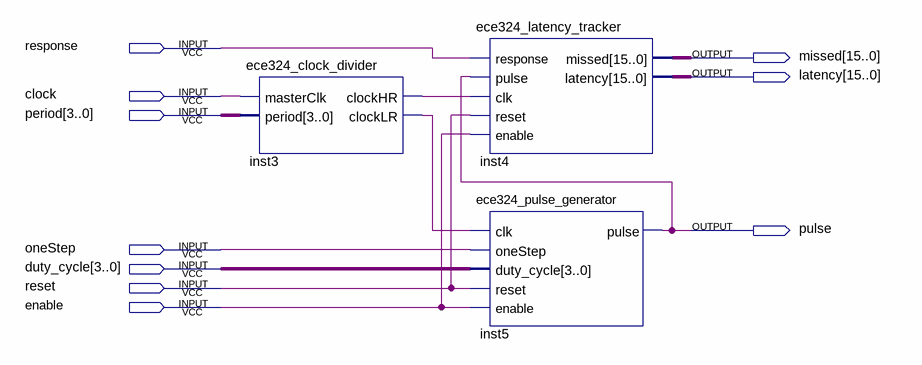
[diagram p0: schematic sheet]
// Quartus schematic ece324_egm.bdf as structural Verilog: 3 symbols, 10 pins
module ece324_egm (
  input  response,
  input  clock,
  input  [3:0] period,
  input  oneStep,
  input  [3:0] duty_cycle,
  input  reset,
  input  enable,
  output [15:0] missed,
  output [15:0] latency,
  output pulse
);

  wire inst3_clockhr, inst3_clocklr;

  ece324_clock_divider inst3 (.masterClk(clock), .period(period), .clockHR(inst3_clockhr), .clockLR(inst3_clocklr));
  ece324_latency_tracker inst4 (
    .response(response), .pulse(pulse), .clk(inst3_clockhr), .reset(reset), .enable(enable), .missed(missed),
    .latency(latency));
  ece324_pulse_generator inst5 (
    .clk(inst3_clocklr), .oneStep(oneStep), .duty_cycle(duty_cycle), .reset(reset), .enable(enable),
    .pulse(pulse));
endmodule
